# EAGLE design ATmega16 Testboard v2.2 (EAGLE 4.16)
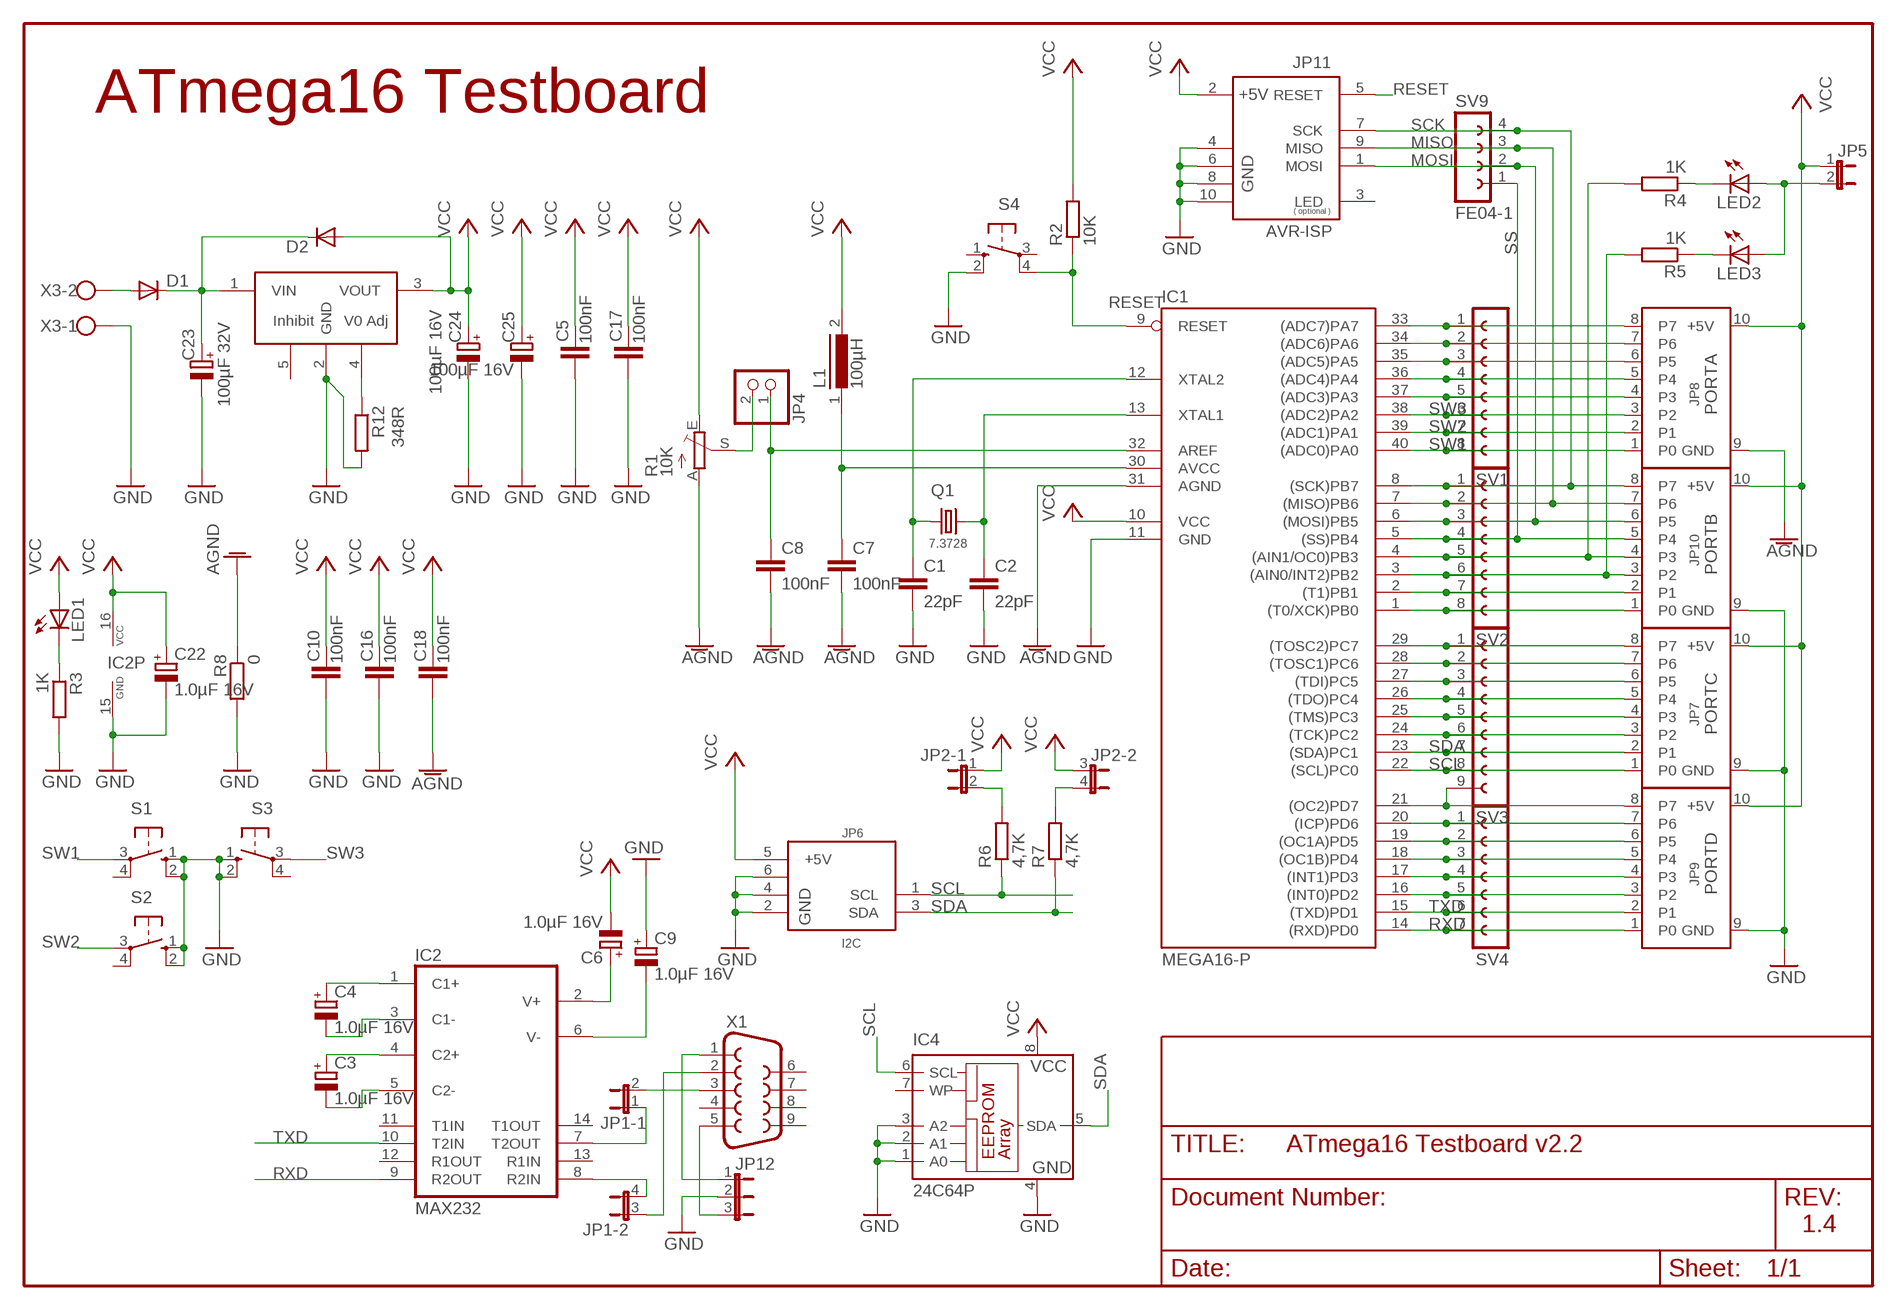
[diagram p0: schematic, sheet 1, part 1 of 2]
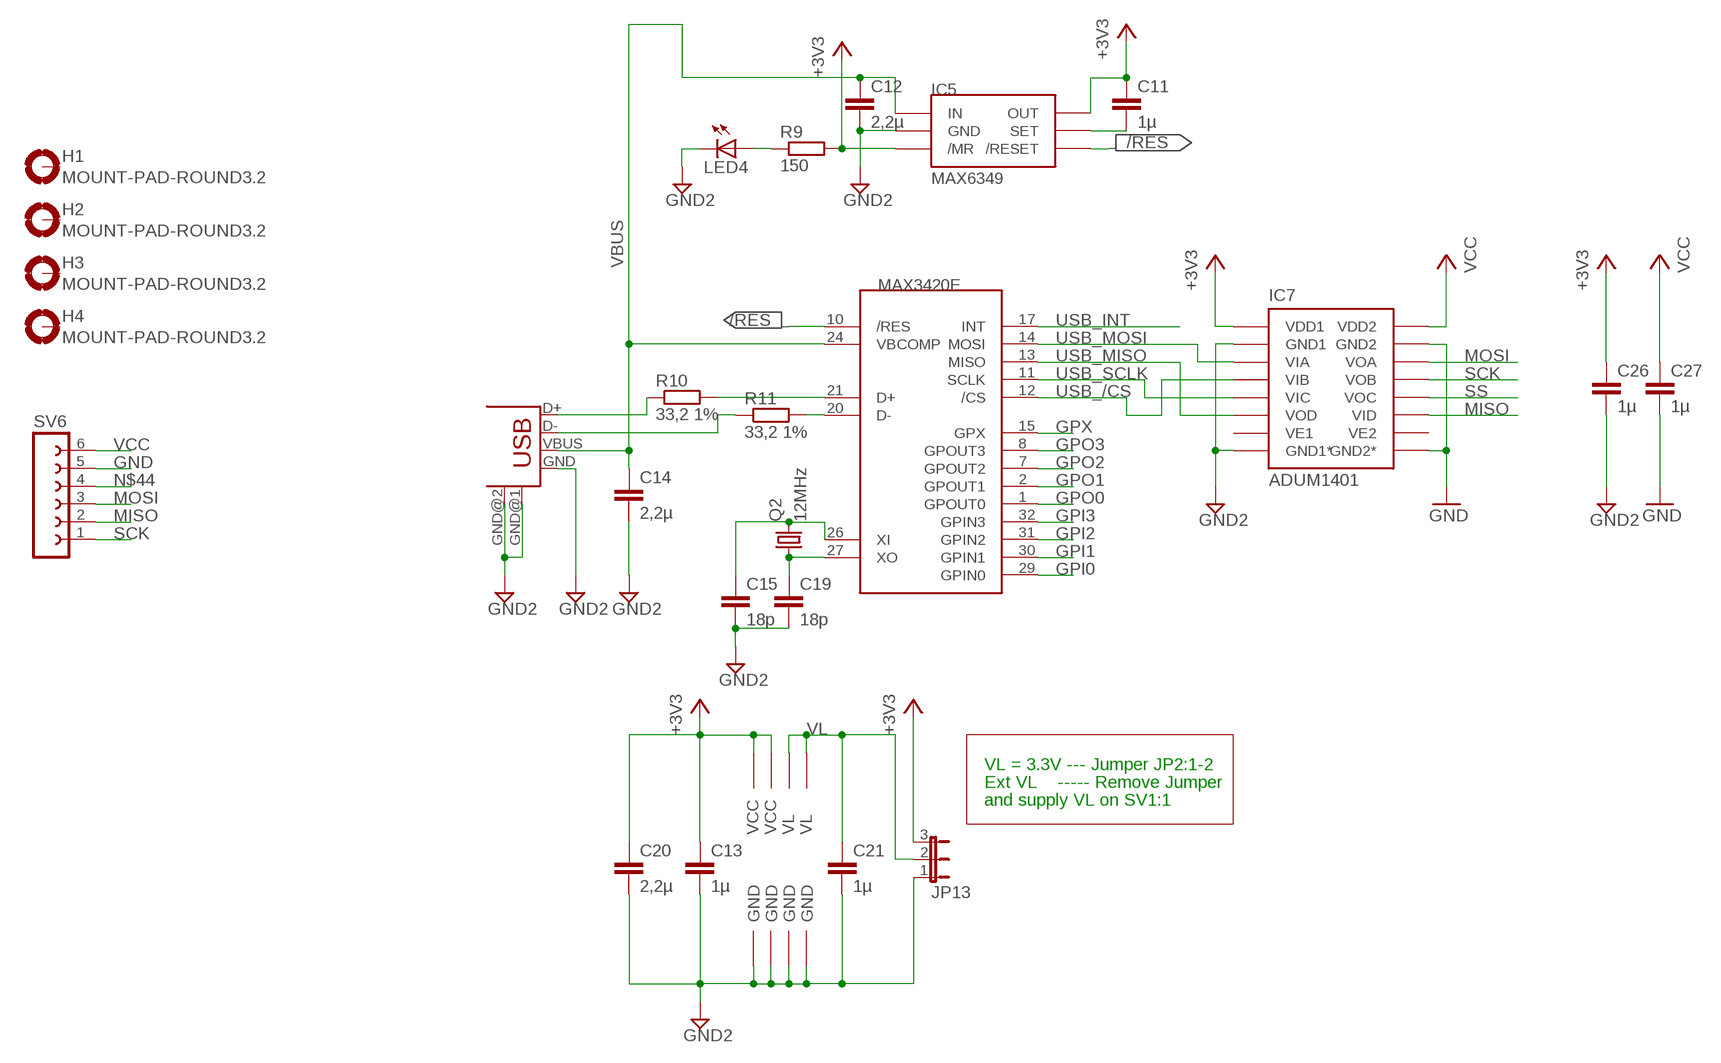
[diagram p1: schematic, sheet 1, part 2 of 2]

## Parts
C1  22pF  C-EU025-024X044  [C025-024X044]
C2  22pF  C-EU025-024X044  [C025-024X044]
C3  1.0µF 16V  CPOL-EUE1.8-4  [E1,8-4]
C4  1.0µF 16V  CPOL-EUE1.8-4  [E1,8-4]
C5  100nF  C-EU025-024X044  [C025-024X044]
C6  1.0µF 16V  CPOL-EUE1.8-4  [E1,8-4]
C7  100nF  C-EU025-024X044  [C025-024X044]
C8  100nF  C-EU025-024X044  [C025-024X044]
C9  1.0µF 16V  CPOL-EUE1.8-4  [E1,8-4]
C10  100nF  C-EU025-024X044  [C025-024X044]
C11  1µ  C-EUC0603  [C0603]
C12  2,2µ  C-EUC0603  [C0603]
C13  1µ  C-EUC0603  [C0603]
C14  2,2µ  C-EUC0603  [C0603]
C15  18p  C-EUC0402  [C0402]
C16  100nF  C-EU025-024X044  [C025-024X044]
C17  100nF  C-EU025-024X044  [C025-024X044]
C18  100nF  C-EU025-024X044  [C025-024X044]
C19  18p  C-EUC0402  [C0402]
C20  2,2µ  C-EUC0603  [C0603]
C21  1µ  C-EUC0603  [C0603]
C22  1.0µF 16V  CPOL-EUE1.8-4  [E1,8-4]
C23  100µF 32V  CPOL-EUE2.5-7  [E2,5-7]
C24  100µF 16V  CPOL-EUE2.5-6  [E2,5-6]
C25  100µF 16V  CPOL-EUE2.5-6  [E2,5-6]
C26  1µ  C-EUC0603  [C0603]
C27  1µ  C-EUC0603  [C0603]
D1  DIODE-DO34-7  [DO34-7]
D2  DIODE-DO34-7  [DO34-7]
H1  MOUNT-PAD-ROUND3.2  [3,2-PAD]
H2  MOUNT-PAD-ROUND3.2  [3,2-PAD]
H3  MOUNT-PAD-ROUND3.2  [3,2-PAD]
H4  MOUNT-PAD-ROUND3.2  [3,2-PAD]
IC1  MEGA16-P  [DIL40]
IC2  MAX232  [DIL16]
IC3  MAX3420E  [LQFP32]
IC4  24C64P  [DIL8]
IC5  MAX6349  [SOT23-6]
IC6  PTH08080W  [5DIP_MODUL]
IC7  ADUM1401  [SO16W]
JP1  JP2QE  [JP2Q]
JP2  JP2QE  [JP2Q]
JP4  PINHD-1X2V  [1X02/90]
JP5  JP1E  [JP1]
JP6  I2C  [ML6]
JP7  PORTC  PORT  [ML10]
JP8  PORTA  PORT  [ML10]
JP9  PORTD  PORT  [ML10]
JP10  PORTB  PORT  [ML10]
JP11  AVR-ISP  [ML10]
JP12  JP2E  [JP2]
JP13  JP2E  [JP2]
L1  100µH  BC12  [BC12]
LED1  LED3MM  [LED3MM]
LED2  LED3MM  [LED3MM]
LED3  LED3MM  [LED3MM]
LED4  LEDCHIPLED_0805  [CHIPLED_0805]
Q1  7.3728  CRYTALHC49U-V  [HC49U-V]
Q2  12MHz  CRYTALHC49U-V  [HC49U-V]
R1  10K  TRIM_EU-S64Y  [S64Y]
R2  10K  R-EU_0207/7  [0207/7]
R3  1K  R-EU_0207/7  [0207/7]
R4  1K  R-EU_0207/7  [0207/7]
R5  1K  R-EU_0207/7  [0207/7]
R6  4,7K  R-EU_0207/7  [0207/7]
R7  4,7K  R-EU_0207/7  [0207/7]
R8  0  R-EU_0207/2V  [0207/2V]
R9  150  R-EU_R0603  [R0603]
R10  33,2 1%  R-EU_R0603  [R0603]
R11  33,2 1%  R-EU_R0603  [R0603]
R12  348R  R-EU_0207/7  [0207/7]
S1  10-XX  [B3F-10XX]
S2  10-XX  [B3F-10XX]
S3  10-XX  [B3F-10XX]
S4  10-XX  [B3F-10XX]
SV1  FE08-1  [FE08]
SV2  FE08-1  [FE08]
SV3  FE09-1  [FE09]
SV4  FE07-1  [FE07]
SV6  FE06-1  [FE06]
SV9  FE04-1  [FE04]
USB1  USB-B-H  [USB-B-H]
X1  F09HP  [F09HP]
X3  W237-02P  [W237-132]

## Nets
+3V3 [SUP]: C11.1 C13.1 C20.1 C26.1 IC3.22(PWR:VCC$1) IC3.23(PWR:VCC$2) IC5.P$3(/MR) IC5.P$6(OUT) IC7.1(VDD1) JP13.3 R9.2
/RES: IC3.10(/RES) IC5.P$4(/RESET)
AGND [PWR]: C7.2 C8.2 C18.2 IC1.31(AGND) JP8.9(GND) R1.A R8.1
AREF: C8.1 IC1.32(AREF) JP4.1
AVCC: C7.1 IC1.30(AVCC) L1.1
GND [PWR]: C1.2 C2.2 C5.2 C9.+ C10.2 C16.2 C17.2 C22.- C23.- C24.- C25.- C27.2 IC1.11(GND) IC2.15(GND) IC4.1(A0) IC4.2(A1) IC4.3(A2) IC4.4(GND) IC6.2(GND) IC7.9(GND2*) IC7.15(GND2) JP6.2(GND$3) JP6.4(GND$2) JP6.6(GND$1) JP7.9(GND) JP9.9(GND) JP10.9(GND) JP11.4(GND1) JP11.6(GND2) JP11.8(GND3) JP11.10(GND4) JP12.2 R3.2 R8.2 R12.2 S1.1(S) S1.2(S1) S2.1(S) S2.2(S1) S3.1(S) S3.2(S1) S4.2(S1) SV6.5 X3.1
GND2 [GND2]: C12.2 C13.2 C14.2 C15.2 C19.2 C20.2 C21.2 C26.2 IC3.5(PWR:GND$1) IC3.6(PWR:GND$2) IC3.18(PWR:GND$3) IC3.19(PWR:GND$4) IC5.P$2(GND) IC7.2(GND1) IC7.8(GND1*) JP13.1 LED4.C USB1.GND USB1.GND@1(GND) USB1.GND@2(GND)
GPI0: IC3.29(GPIN0)
GPI1: IC3.30(GPIN1)
GPI2: IC3.31(GPIN2)
GPI3: IC3.32(GPIN3)
GPO0: IC3.1(GPOUT0)
GPO1: IC3.2(GPOUT1)
GPO2: IC3.7(GPOUT2)
GPO3: IC3.8(GPOUT3)
GPX: IC3.15(GPX)
INT: IC1.24((TCK)PC2) JP7.3(P2) SV3.6
MISO [SPI]: IC1.7((MISO)PB6) IC7.11(VID) JP10.7(P6) JP11.9(MISO) SV2.2 SV6.2 SV9.3
MOSI [SPI]: IC1.6((MOSI)PB5) IC7.14(VOA) JP10.6(P5) JP11.1(MOSI) SV2.3 SV6.3 SV9.2
N$1: C4.+ IC2.1(C1+)
N$2: C4.- IC2.3(C1-)
N$3: C3.+ IC2.4(C2+)
N$4: JP4.2 R1.S
N$5: IC1.3((AIN0/INT2)PB2) JP10.3(P2) R5.2 SV2.6
N$6: C2.1 IC1.13(XTAL1) Q1.2
N$7: C1.1 IC1.12(XTAL2) Q1.1
N$8: C3.- IC2.5(C2-)
N$9: C6.+ IC2.2(V+)
N$10: C9.- IC2.6(V-)
N$11: C11.2 IC5.P$5(SET)
N$12: IC1.29((TOSC2)PC7) JP7.8(P7) SV3.1
N$13: IC1.28((TOSC1)PC6) JP7.7(P6) SV3.2
N$14: IC1.27((TDI)PC5) JP7.6(P5) SV3.3
N$15: IC1.26((TDO)PC4) JP7.5(P4) SV3.4
N$16: IC1.25((TMS)PC3) JP7.4(P3) SV3.5
N$17: JP2.4 R7.2
N$18 [PWR]: C23.+ D1.C D2.C IC6.1(VIN)
N$19: JP2.2 R6.2
N$20: JP12.1 X1.1
N$21: IC1.21((OC2)PD7) JP9.8(P7) SV3.9
N$22: IC1.20((ICP)PD6) JP9.7(P6) SV4.1
N$23: IC1.19((OC1A)PD5) JP9.6(P5) SV4.2
N$24: IC1.18((OC1B)PD4) JP9.5(P4) SV4.3
N$25: IC1.17((INT1)PD3) JP9.4(P3) SV4.4
N$26: IC2.7(T2OUT) JP1.1
N$27: D1.A X3.2
N$28: JP12.3 X1.5
N$29: IC2.8(R2IN) JP1.4
N$30: LED4.A R9.1
N$31: IC3.20(D-) R11.2
N$33: R11.1 USB1.D-
N$34: IC3.21(D+) R10.2
N$35: R10.1 USB1.D+
N$36: C19.1 IC3.27(XO) Q2.1
N$37: C15.1 IC3.26(XI) Q2.2
N$42: IC6.4(VADJ) R12.1
N$44: IC1.4((AIN1/OC0)PB3) JP10.4(P3) R4.2 SV2.5 SV6.4
N$46: IC1.2((T1)PB1) JP10.2(P1) SV2.7
N$47: IC1.1((T0/XCK)PB0) JP10.1(P0) SV2.8
N$48: IC1.16((INT0)PD2) JP9.3(P2) SV4.5
N$68: LED3.K(C) R5.1
N$69: LED2.K(C) R4.1
N$71: JP5.2 LED2.A LED3.A
N$74: LED1.K(C) R3.1
PA3: IC1.37((ADC3)PA3) JP8.4(P3) SV1.5
PA4: IC1.36((ADC4)PA4) JP8.5(P4) SV1.4
PA5: IC1.35((ADC5)PA5) JP8.6(P5) SV1.3
PA6: IC1.34((ADC6)PA6) JP8.7(P6) SV1.2
PA7: IC1.33((ADC7)PA7) JP8.8(P7) SV1.1
RESET: IC1.9(RESET) JP11.5(RESET) R2.1 S4.4(P1)
RXD: IC1.14((RXD)PD0) IC2.9(R2OUT) JP9.1(P0) SV4.7
SCK [SPI]: IC1.8((SCK)PB7) IC7.13(VOB) JP10.8(P7) JP11.7(SCK) SV2.1 SV6.1 SV9.4
SCL: IC1.22((SCL)PC0) IC4.6(SCL) JP6.1(SCL) JP7.1(P0) R6.1 SV3.8
SDA: IC1.23((SDA)PC1) IC4.5(SDA) JP6.3(SDA) JP7.2(P1) R7.1 SV3.7
SRXD: JP1.3 X1.2
SS [SPI]: IC1.5((SS)PB4) IC7.12(VOC) JP10.5(P4) SV2.4 SV9.1
STXD: JP1.2 X1.3
SW1: IC1.40((ADC0)PA0) JP8.1(P0) S1.3(P) SV1.8
SW2: IC1.39((ADC1)PA1) JP8.2(P1) S2.3(P) SV1.7
SW3: IC1.38((ADC2)PA2) JP8.3(P2) S3.3(P) SV1.6
TXD: IC1.15((TXD)PD1) IC2.10(T2IN) JP9.2(P1) SV4.6
USB_/CS: IC3.12(/CS) IC7.4(VIB)
USB_INT: IC3.17(INT)
USB_MISO: IC3.13(MISO) IC7.6(VOD)
USB_MOSI: IC3.14(MOSI) IC7.3(VIA)
USB_SCLK: IC3.11(SCLK) IC7.5(VIC)
VBUS [SUP]: C12.1 C14.1 IC3.24(VBCOMP) IC5.P$1(IN) USB1.VBUS
VCC [PWR]: C5.1 C6.- C10.1 C16.1 C17.1 C18.1 C22.+ C24.+ C25.+ C27.1 D2.A IC1.10(VCC) IC2.16(VCC) IC4.8(VCC) IC6.3(VOUT) IC7.16(VDD2) JP2.1 JP2.3 JP5.1 JP6.5(+5V) JP7.10(+5V) JP8.10(+5V) JP9.10(+5V) JP10.10(+5V) JP11.2(+5V) L1.2 LED1.A R1.E R2.2 SV6.6
VL [SUP]: C21.1 IC3.3(PWR:VL$1) IC3.4(PWR:VL$2) JP13.2
Unconnected: H1.B3,2(MOUNT) H2.B3,2(MOUNT) H3.B3,2(MOUNT) H4.B3,2(MOUNT) IC2.11(T1IN) IC2.12(R1OUT) IC2.13(R1IN) IC2.14(T1OUT) IC4.7(WP) IC6.5(INHIBIT) IC7.7(VE1) IC7.10(VE2) S1.4(P1) S2.4(P1) S3.4(P1) S4.1(S) S4.3(P) X1.4 X1.6 X1.7 X1.8 X1.9

## Notes on the sheet
- ATmega16 Testboard
- VL = 3.3V --- Jumper JP2:1-2
- Ext VL    ----- Remove Jumper
- and supply VL on SV1:1
- 1.4

## Power pins joined to a net without a drawn wire
LED: JP11.3(LED)

## Library data of the parts
C1 C2 C5 C7 C8 C10-C21 C26 C27 = rcl:C-EU: CAPACITOR, European symbol
C3 C4 C6 C9 C22-C25 = rcl:CPOL-EU: POLARIZED CAPACITOR, European symbol
D1 D2 = diode:DIODE-: DIODE
H1-H4 = holes:MOUNT-PAD-ROUND: MOUNTING PAD, round
IC1 = avr:MEGA16-P
IC2 = maxim:MAX232: RS232 TRANSEIVER
IC3 = maxim:MAX3420: MAX3420E USB Peripheral Controller with SPI Interface The MAX3420E contains the digital logic and analog circuitry necessary to implement a full-speed USB peripheral compliant to USB specification rev 2.0. A built-in full-speed transceiver features ±15kV ESD protection and programmable USB connect and disconnect. An internal serial-interface engine (SIE) handles low-level USB protocol details such as error checking and bus retries. The MAX3420E operates using a register set accessed by an SPI? interface that operates up to 26MHz. Any SPI master (microprocessor, ASIC, DSP, etc.) can add USB functionality using the simple 3- or 4-wire SPI interface.
IC4 = microchip:24*: Serial EEPROM I2C
IC5 = maxim:MAX6349
IC6 = I2C:PTH08080W
IC7 = analog-devices:ADUM1401
JP1 JP2 = jumper:JP2QE: JUMPER
JP4 = pinhead:PINHD-1X2: PIN HEADER
JP5 = jumper:JP1E: JUMPER
JP6 = I2C:I2C
JP7-JP10 = andereBauteile:PORT
JP11 = roboternetz-definitionen:AVR-ISP: AVR ISP ( In System Programm ) Stecker
JP12 JP13 = jumper:JP2E: JUMPER
L1 = inductors:BC12: INDUCTOR
LED1-LED4 = led:LED: LED OSRAM: - CHIPLED LG R971, LG N971, LY N971, LG Q971, LY Q971, LO R971, LY R971 LH N974, LH R974 LS Q976, LO Q976, LY Q976 LO Q996 - Hyper CHIPLED LW Q18S LB Q993, LB Q99A, LB R99A - SideLED LS A670, LO A670, LY A670, LG A670, LP A670 LB A673, LV A673, LT A673, LW A673 LH A674 LY A675 LS A676, LA A676, LO A676, LY A676, LW A676 LS A679, LY A679, LG A679 - Hyper Micro SIDELED® LS Y876, LA Y876, LO Y876, LY Y876 LT Y87S - SmartLED LW L88C, LW L88S LB L89C, LB L89S, LG L890 LS L89K, LO L89K, LY L89K LS L896, LA L896, LO L896, LY L896 - TOPLED LS T670, LO T670, LY T670, LG T670, LP T670 LSG T670, LSP T670, LSY T670, LOP T670, LYG T670 LG T671, LOG T671, LSG T671 LB T673, LV T673, LT T673, LW T673 LH T674 LS T676, LA T676, LO T676, LY T676, LB T676, LH T676, LSB T676, LW T676 LB T67C, LV T67C, LT T67C, LS T67K, LO T67K, LY T67K, LW E67C LS E67B, LA E67B, LO E67B, LY E67B, LB E67C, LV E67C, LT E67C LW T67C LS T679, LY T679, LG T679 LS T770, LO T770, LY T770, LG T770, LP T770 LB T773, LV T773, LT T773, LW T773 LH T774 LS E675, LA E675, LY E675, LS T675 LS T776, LA T776, LO T776, LY T776, LB T776 LHGB T686 LT T68C, LB T68C - Hyper Mini TOPLED® LB M676 - Mini TOPLED Santana® LG M470 LS M47K, LO M47K, LY M47K Source: http://www.osram.convergy.de/
Q1 Q2 = crystal:CRYTAL: CRYSTAL
R1 = pot:TRIM_EU-: POTENTIOMETER
R2-R12 = rcl:R-EU_: RESISTOR, European symbol
S1-S4 = switch-omron:10-XX: OMRON SWITCH
SV1 SV2 = con-lsta:FE08-1: FEMALE HEADER
SV3 = con-lsta:FE09-1: FEMALE HEADER
SV4 = con-lsta:FE07-1: FEMALE HEADER
SV6 = con-lsta:FE06-1: FEMALE HEADER
SV9 = con-lsta:FE04-1: FEMALE HEADER
USB1 = con-usb-2:USB: USB Connectors
X1 = con-subd:F09: SUB-D
X3 = con-wago-508:W237-02P: WAGO SREW CLAMP

## Board
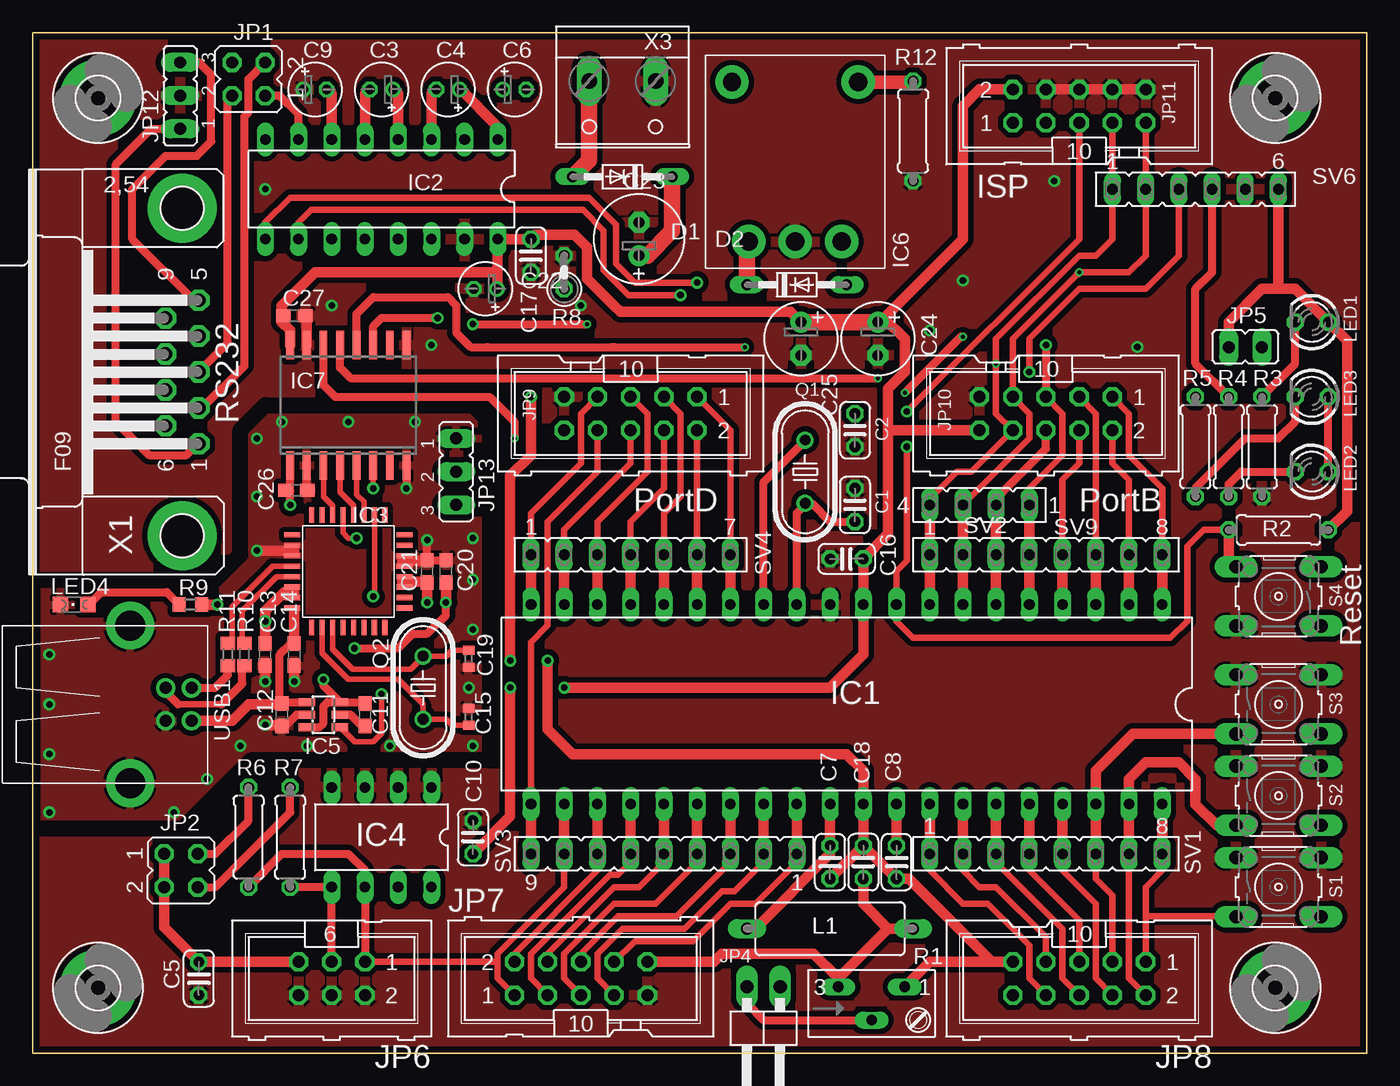
[diagram p2: board, top side]
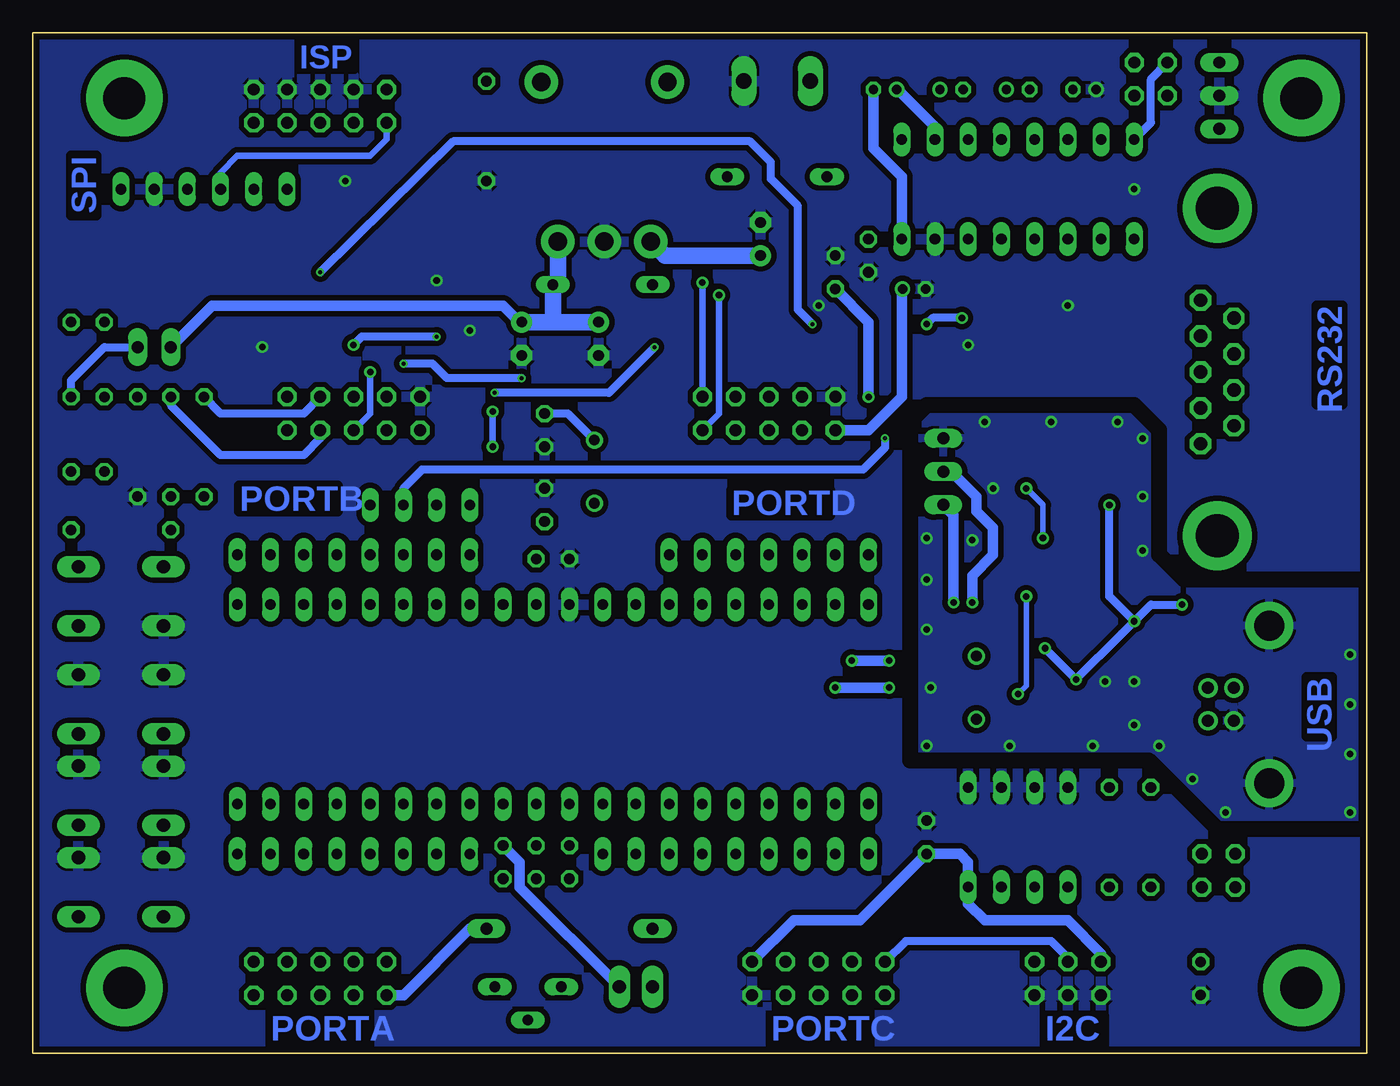
[diagram p3: board, bottom side, seen from below]

Size 102 x 78 mm. Coordinates in mm from the lower left corner, seen from the top.
Outline: 0,0 0,78 102,78 102,0 0,0
Copper layers (1*16): Top 0.035mm / dielectric 1.5mm / Bottom 0.035mm
Design rules "leiton": minimum track width 12mil, minimum drill 12mil, track to track 6mil, track to pad 6mil, pad to pad 6mil, via to via 6mil, smd to smd 6mil, copper to edge 20mil, drill to drill 8mil, minimum pad ring 8mil, minimum via ring 6mil, stop-mask expansion 3mil, vias tented up to drill 0mil, thermal gap 8mil
tRestrict: 11 lines
bRestrict: 11 lines
Milling: 4 lines

### Footprints (pad centres in the part's own frame; a part is rotated, then mirrored left to right if it is on the bottom)
C025-024X044 = drill 0.813 octagon: 1 -1.27,0; 2 1.27,0
E1,8-4 = drill 0.711 pad 1.168 round: + -0.889,0 | drill 0.711 pad 1.168 octagon: - 0.889,0
C0603 = smd 1.1 x 1: 1 -0.85,0; 2 0.85,0
C0402 = smd 0.7 x 0.9: 1 -0.65,0; 2 0.65,0
E2,5-7 = drill 0.813 pad 1.6 round: + -1.27,0 | drill 0.813 pad 1.6 octagon: - 1.27,0
E2,5-6 = drill 0.813 pad 1.6 round: + -1.27,0 | drill 0.813 pad 1.6 octagon: - 1.27,0
DO34-7 = drill 0.813 long: A 3.81,0; C -3.81,0
3,2-PAD = drill 3.2 pad 5.842 round: B3,2 0,0
DIL40 = drill 0.813 long: 1 -24.13,-7.62; 2 -21.59,-7.62; 3 -19.05,-7.62; 4 -16.51,-7.62; 5 -13.97,-7.62; 6 -11.43,-7.62; 7 -8.89,-7.62; 8 -6.35,-7.62; 9 -3.81,-7.62; 10 -1.27,-7.62; 11 1.27,-7.62; 12 3.81,-7.62; 13 6.35,-7.62; 14 8.89,-7.62; 15 11.43,-7.62; 16 13.97,-7.62; 17 16.51,-7.62; 18 19.05,-7.62; 19 21.59,-7.62; 20 24.13,-7.62; 21 24.13,7.62; 22 21.59,7.62; 23 19.05,7.62; 24 16.51,7.62; 25 13.97,7.62; 26 11.43,7.62; 27 8.89,7.62; 28 6.35,7.62; 29 3.81,7.62; 30 1.27,7.62; 31 -1.27,7.62; 32 -3.81,7.62; 33 -6.35,7.62; 34 -8.89,7.62; 35 -11.43,7.62; 36 -13.97,7.62; 37 -16.51,7.62; 38 -19.05,7.62; 39 -21.59,7.62; 40 -24.13,7.62
DIL16 = drill 0.813 long: 1 -8.89,-3.81; 2 -6.35,-3.81; 3 -3.81,-3.81; 4 -1.27,-3.81; 5 1.27,-3.81; 6 3.81,-3.81; 7 6.35,-3.81; 8 8.89,-3.81; 9 8.89,3.81; 10 6.35,3.81; 11 3.81,3.81; 12 1.27,3.81; 13 -1.27,3.81; 14 -3.81,3.81; 15 -6.35,3.81; 16 -8.89,3.81
LQFP32 = smd 0.4 x 1.2: 1 -2.8,-4.3; 2 -2,-4.3; 3 -1.2,-4.3; 4 -0.4,-4.3; 5 0.4,-4.3; 6 1.2,-4.3; 7 2,-4.3; 8 2.8,-4.3; 17 2.8,4.3; 18 2,4.3; 19 1.2,4.3; 20 0.4,4.3; 21 -0.4,4.3; 22 -1.2,4.3; 23 -2,4.3; 24 -2.8,4.3 | smd 1.2 x 0.4: 9 4.3,-2.8; 10 4.3,-2; 11 4.3,-1.2; 12 4.3,-0.4; 13 4.3,0.4; 14 4.3,1.2; 15 4.3,2; 16 4.3,2.8; 25 -4.3,2.8; 26 -4.3,2; 27 -4.3,1.2; 28 -4.3,0.4; 29 -4.3,-0.4; 30 -4.3,-1.2; 31 -4.3,-2; 32 -4.3,-2.8
DIL8 = drill 0.813 long: 1 -3.81,-3.81; 2 -1.27,-3.81; 3 1.27,-3.81; 4 3.81,-3.81; 5 3.81,3.81; 6 1.27,3.81; 7 -1.27,3.81; 8 -3.81,3.81
SOT23-6 = smd 0.635 x 1.27: P$1 -0.953,-1.27; P$2 0,-1.27; P$3 0.953,-1.27; P$4 0.953,1.27; P$5 0,1.27; P$6 -0.953,1.27
5DIP_MODUL = drill 1.4 pad 2.54 round: 1 -5.588,3.048; 2 -5.588,-0.508; 3 -5.588,-4.064; 4 6.604,-5.334; 5 6.604,4.318
SO16W = smd 0.6 x 2.2: 1 -4.445,-4.6; 2 -3.175,-4.6; 3 -1.905,-4.6; 4 -0.635,-4.6; 5 0.635,-4.6; 6 1.905,-4.6; 7 3.175,-4.6; 8 4.445,-4.6; 9 4.445,4.6; 10 3.175,4.6; 11 1.905,4.6; 12 0.635,4.6; 13 -0.635,4.6; 14 -1.905,4.6; 15 -3.175,4.6; 16 -4.445,4.6
JP2Q = drill 0.914 octagon: 1 -1.27,-1.27; 2 -1.27,1.27; 3 1.27,-1.27; 4 1.27,1.27
1X02/90 = drill 1.016 long: 1 -1.27,0; 2 1.27,0
JP1 = drill 0.914 long: 1 0,-1.27; 2 0,1.27
ML6 = drill 0.914 octagon: 1 -2.54,-1.27; 2 -2.54,1.27; 3 0,-1.27; 4 0,1.27; 5 2.54,-1.27; 6 2.54,1.27
ML10 = drill 0.914 octagon: 1 -5.08,-1.27; 2 -5.08,1.27; 3 -2.54,-1.27; 4 -2.54,1.27; 5 0,-1.27; 6 0,1.27; 7 2.54,-1.27; 8 2.54,1.27; 9 5.08,-1.27; 10 5.08,1.27
JP2 = drill 0.914 long: 1 -2.54,0; 2 0,0; 3 2.54,0
BC12 = drill 0.914 long: 1 -6.35,0; 2 6.35,0
LED3MM = drill 0.813 octagon: A -1.27,0; K 1.27,0
CHIPLED_0805 = smd 1.2 x 1.2: A 0,-1.05; C 0,1.05
HC49U-V = drill 0.813 round: 1 -2.413,0; 2 2.413,0
S64Y = drill 0.813 long: A 2.54,1.27; E -2.54,1.27; S 0,-1.27
0207/7 = drill 0.813 octagon: 1 -3.81,0; 2 3.81,0
0207/2V = drill 0.813 octagon: 1 -1.27,0; 2 1.27,0
R0603 = smd 1 x 1.1: 1 -0.85,0; 2 0.85,0
B3F-10XX = drill 1.016 long: 1 -3.251,2.261; 2 3.251,2.261; 3 -3.251,-2.261; 4 3.251,-2.261
FE08 = drill 0.813 long: 1 -8.89,0; 2 -6.35,0; 3 -3.81,0; 4 -1.27,0; 5 1.27,0; 6 3.81,0; 7 6.35,0; 8 8.89,0
FE09 = drill 0.813 long: 1 -10.16,0; 2 -7.62,0; 3 -5.08,0; 4 -2.54,0; 5 0,0; 6 2.54,0; 7 5.08,0; 8 7.62,0; 9 10.16,0
FE07 = drill 0.813 long: 1 -7.62,0; 2 -5.08,0; 3 -2.54,0; 4 0,0; 5 2.54,0; 6 5.08,0; 7 7.62,0
FE06 = drill 0.813 long: 1 -6.35,0; 2 -3.81,0; 3 -1.27,0; 4 1.27,0; 5 3.81,0; 6 6.35,0
FE04 = drill 0.813 long: 1 -3.81,0; 2 -1.27,0; 3 1.27,0; 4 3.81,0
USB-B-H = drill 0.914 round: D+ 0,1.25; D- 1.981,1.25; GND 0,-1.25; VBUS 1.981,-1.25 | drill 2.286 round: GND@1 -2.718,6.02; GND@2 -2.718,-6.02
F09HP = drill 1.016 octagon: 1 -5.486,-1.27; 2 -2.743,-1.27; 3 0,-1.27; 4 2.743,-1.27; 5 5.486,-1.27; 6 -4.115,1.27; 7 -1.372,1.27; 8 1.372,1.27; 9 4.115,1.27 | drill 3.302 pad 5.08 round: G1 -12.522,0; G2 12.522,0
W237-132 = drill 1.194 long: 1 -2.54,-0.635; 2 2.54,-0.635

### Placement (x,y rotation side)
C1  62.87,41.91 90 top
C2  62.87,47.62 270 top
C3  26.67,73.66 180 top
C4  31.75,73.66 180 top
C5  12.7,5.71 270 top
C6  36.83,73.66 0 top
C7  60.96,14.61 270 top
C8  66.04,14.61 270 top
C9  21.59,73.66 0 top
C10  33.66,16.51 90 top
C11  25.4,25.88 270 top
C12  19.05,25.88 270 top
C13  17.78,30.48 270 top
C14  20,30.48 270 top
C15  33.34,25.72 90 top
C16  62.23,37.78 180 top
C17  38.1,60.96 270 top
C18  63.5,14.61 90 top
C19  33.34,30.16 270 top
C20  31.59,36.83 90 top
C21  30.16,36.83 90 top
C22  34.61,58.42 180 top
C23  46.35,62.23 90 top
C24  64.61,54.61 270 top
C25  58.74,54.61 270 top
C26  20.16,43.02 0 top
C27  20,56.36 0 top
D1  45.09,66.99 180 top
D2  58.42,58.74 0 top
H1  5,5 0 top
H2  95,5 0 top
H3  95,73 0 top
H4  5,73 0 top
IC1  62.23,26.67 180 top
IC2  26.67,66.04 180 top
IC3  24.13,36.83 90 top
IC4  26.67,16.51 180 top
IC5  22.23,25.88 270 top
IC6  57.78,67.63 90 top
IC7  24.13,49.53 0 top
JP1  16.51,74.45 90 top
JP2  11.34,13.97 270 top
JP4  55.88,5.08 180 top
JP5  92.71,53.98 270 top
JP6  22.86,5.71 180 top
JP7  41.91,5.71 0 top
JP8  80.01,5.71 180 top
JP9  45.72,48.9 180 top
JP10  77.47,48.9 180 top
JP11  80.01,72.39 0 top
JP12  11.27,73.18 90 top
JP13  32.38,44.45 270 top
L1  60.96,9.53 0 top
LED1  97.79,55.88 180 top
LED2  97.79,44.45 180 top
LED3  97.79,50.16 180 top
LED4  3.17,34.29 90 top
Q1  59.05,44.45 90 top
Q2  29.84,27.94 270 top
R1  64.14,3.81 0 top
R2  95.25,40.01 0 top
R3  93.98,46.35 270 top
R4  91.44,46.35 90 top
R5  88.9,46.35 90 top
R6  16.51,16.51 90 top
R7  19.68,16.51 90 top
R8  40.64,59.69 90 top
R9  12.06,34.29 0 top
R10  16.19,30.48 90 top
R11  14.92,30.48 90 top
R12  67.31,70.48 270 top
S1  95.25,12.7 0 top
S2  95.25,19.68 0 top
S3  95.25,26.67 0 top
S4  95.25,34.92 180 top
SV1  77.47,15.24 0 top
SV2  77.47,38.1 0 top
SV3  48.26,15.24 180 top
SV4  45.72,38.1 0 top
SV6  88.9,66.04 0 top
SV9  72.39,41.91 180 top
USB1  10.16,26.67 0 top
X1  11.43,52.07 90 top
X3  45.09,73.66 180 top

### Tracks (layer width: path | path; a pad name or v marks a point on that pad's centre or on a via)
+3V3  (via drill 0.5)
  Top 0.406: IC3.23 19.83,35.07 20,35.24 19.83,35.41 IC3.22
  Top 0.61: IC5.P$3 21.91,24.92 22.23,25.24 22.23,26.51 22.54,26.83 IC5.P$6 | C11.1 25.4,26.67 25.24,26.83 IC5.P$6 | 17.84,31.27 17.84,31.33 | v24.61,30.96 27.94,30.96 29.05,32.07 30.16,32.07 31.59,33.5 v31.59,34.45 | v22.23,28.57 22.23,28.1 IC5.P$6 | IC7.1 v19.68,41.91 19.68,42.97 C26.1
  Top 0.813: 20,35.24 19.21,35.24 17.78,33.81 v17.78,33.02 C13.1 17.84,31.27 | v14.13,34.29 R9.2 | v31.59,34.45 C20.1
  Bottom 0.61: v24.61,30.96 v22.23,28.57 18.73,32.07 v17.78,33.02 | v14.13,34.29 16.51,34.29 v17.78,33.02 | v19.68,41.91 19.68,34.92 v17.78,33.02
  Bottom 0.813: v31.59,34.45 31.59,41.12 JP13.3
/RES  (via drill 0.5)
  Top 0.406: IC3.10 26.13,35.02 v26.04,34.92 | v26.67,27.46 26.67,24.45 26.04,23.81 24.61,23.81 IC5.P$4
  Bottom 0.406: v26.04,34.92 26.04,28.1 v26.67,27.46
AGND  (via drill 0.5)
  Top 0.813: 73.34,6.99 68.58,6.99 R1.A | 73.34,6.99 JP8.9 | 73.34,6.99 66.99,13.34 C8.2 C18.2 | C18.2 IC1.31 63.5,21.59 62.23,22.86 41.27,22.86 39.37,24.77 v39.37,30 | C18.2 C7.2 | v36.51,30 36.51,42.23 | 36.51,42.23 | 36.51,42.23 36.51,44.13 38.1,45.72 v38.1,50.16
  Bottom 0.813: v39.37,30 v36.51,30 | R8.1 | R8.1 38.1,55.88 v38.1,50.16
AREF
  Top 0.813: C8.1 IC1.32
  Bottom 0.813: C8.1 64.77,14.61 64.77,12.7 JP4.1
AVCC
  Top 0.813: IC1.30 C7.1 60.96,15.24 55.24,9.53 L1.1
GND  (via drill 0.5)
  Top 0.813: JP11.4 JP11.6 JP11.8 JP11.10 | C27.2 20.95,56.36 IC7.15
  other vias: 30.48,54.13 41.91,57.15 84.45,53.98 68.58,55.24 71.12,59.05 78.11,66.67 17.78,66.04 22.86,57.15
  pour Bottom (isolate 0.406, rank 2): 0,78.74 102.87,78.74 102.87,0 0,0
  pour Top (isolate 0.406, rank 2): 0,78.74 102.87,78.74 102.87,0 0,0
GND2  (via drill 0.5)
  Top 0.406: IC3.6 28.43,37.8 28.26,37.62 28.43,37.45 IC3.5 | IC3.19 19.83,38.24 20,38.42 19.83,38.59 IC3.18
  Top 0.61: 30.16,37.78 v30.16,39.21 | C21.2 30.16,37.78 | C20.2 30.27,37.68 30.16,37.78 | IC5.P$2 20.16,25.88 19.21,24.92 19.05,24.92 C12.2 | IC7.8 v28.57,43.18 | C26.2 21.11,43.18 20.95,43.34 IC7.2
  Top 0.813: C13.2 v17.78,28.42 | C14.2 v20,28.42 | C12.2 18.99,25.08 v17.78,25.08 | C21.2 30.16,37.62 28.26,37.62 | 20,38.42 v17.14,38.42
  other vias: 33.34,27.94 17.14,42.55 17.14,46.99 19.05,48.26 24.13,48.26 29.21,48.26 33.66,39.37 33.66,32.38 33.66,23.5 27.3,23.5 20.95,23.5 15.88,23.5 13.34,20.95 10.79,18.41 33.66,36.2 1.27,18.41 1.27,22.86 1.27,26.67 1.27,30.48
  pour Bottom (isolate 0.406): 0,35.56 13.97,35.56 16.51,38.1 16.51,48.26 17.78,49.53 34.29,49.53 34.29,22.86 16.51,22.86 11.43,17.78 0,17.78
  pour Top (isolate 0.406): 0,35.56 13.97,35.56 16.51,38.1 16.51,48.26 17.78,49.53 34.29,49.53 34.29,22.86 16.51,22.86 11.43,17.78 0,17.78
INT
  Top 0.508: JP7.3 38.1,5.71 38.1,7.62 44.13,13.65 44.77,13.65 45.72,14.61 SV3.6
  Top 0.813: SV3.6 IC1.24
MISO  (via drill 0.3, 0.5)
  Top 0.508: SV9.3 76.2,46.99 76.2,48.9 JP10.7 74.93,54.61 79.93,59.61 v80.01,59.69 83.82,59.69 85.09,60.96 SV6.2 JP11.9
  Top 0.61: v80.01,59.69 79.93,59.61 | IC7.11 26.04,55.56 26.67,56.2 v30.96,56.2 | v33.66,55.72 39.85,55.72 41.91,55.72 v42.39,55.72
  Top 0.813: IC1.7 SV2.2 SV9.3
  Bottom 0.61: v42.39,55.72 43.5,56.83 43.5,64.77 45.56,66.83 45.56,68.1 47.15,69.69 69.85,69.69 v80.01,59.69 | v30.96,56.2 33.18,56.2 v33.66,55.72
MOSI  (via drill 0.3, 0.5)  (1 unrouted)
  Top 0.508: SV6.3 87.63,60.96 85.09,58.42 80.01,58.42 76.2,54.61 v76.2,52.07
  Top 0.61: SV9.2 73.66,42.39 77.47,46.2 JP10.6 | IC7.14 22.23,53.18 22.23,51.06 23.12,50.16 34.92,50.16 36.83,48.26 v36.83,46.99
  Top 0.813: IC1.6 SV2.3 SV9.2
  Bottom 0.508: v76.2,52.07 76.2,48.9 JP10.6 | JP11.1 74.93,69.85 76.2,68.58 86.36,68.58 87.63,67.31 SV6.3
  Bottom 0.61: v36.83,46.99 36.83,46.3 38.52,44.61 72.23,44.61 73.66,43.18 SV9.2
N$1
  Top 0.813: C4.+ 32.7,73.66 35.56,70.8 IC2.1
N$2
  Top 0.813: C4.- 30.8,73.66 30.48,73.34 IC2.3
N$3
  Top 0.813: C3.+ 27.62,73.66 27.94,73.34 IC2.4
N$4
  Top 0.61: JP4.2 54.61,3.81 55.88,2.54 R1.S
N$5
  Top 0.508: SV2.6 81.28,48.9 JP10.3
  Top 0.813: IC1.3 SV2.6
  Bottom 0.61: R5.2 87.63,48.9 81.28,48.9 JP10.3
N$6
  Top 0.61: Q1.2 59.05,46.83 55.88,43.66 IC1.13
  Bottom 0.61: Q1.2 61.09,48.9 C2.1
N$7
  Top 0.61: IC1.12 58.42,41.27 59.05,41.91 Q1.1 59.56,42.04 60.96,40.64 C1.1
N$8
  Top 0.813: C3.- 25.72,73.66 25.4,73.34 IC2.5
N$9
  Bottom 0.813: C6.+ 35.88,73.66 33.02,70.8 IC2.2
N$10
  Top 0.813: C9.- 22.54,73.66 22.86,73.34 IC2.6
N$11
  Top 0.61: C11.2 25.14,25.03 24.29,25.88 IC5.P$5
N$12
  Top 0.508: SV3.1 58.42,14.61 55.24,11.43 53.34,11.43 50.48,8.57 46.04,8.57 JP7.8
  Top 0.813: SV3.1 IC1.29
N$13
  Top 0.508: SV3.2 55.88,14.61 53.66,12.38 52.7,12.38 49.85,9.53 45.09,9.53 43.18,7.62 43.18,5.71 JP7.7
  Top 0.813: SV3.2 IC1.28
N$14
  Top 0.508: SV3.3 53.34,14.61 49.21,10.48 44.77,10.48 41.91,7.62 JP7.6
  Top 0.813: SV3.3 IC1.27
N$15
  Top 0.508: SV3.4 50.8,14.61 47.62,11.43 44.45,11.43 40.64,7.62 40.64,5.71 JP7.5
  Top 0.813: SV3.4 IC1.26
N$16
  Top 0.508: JP7.4 39.37,7.62 44.45,12.7 46.35,12.7 48.26,14.61 SV3.5
  Top 0.813: SV3.5 IC1.25
N$17
  Top 0.61: R7.2 19.68,18.41 13.97,12.7 JP2.4
N$18
  Top 1.27: D1.C 48.9,62.87 46.99,60.96 C23.+ | C23.+ | IC6.1 54.61,61.91 D2.C
  Bottom 1.27: C23.+ | C23.+ 53.66,60.96 IC6.1 54.77,62.07
N$19
  Top 0.61: R6.2 16.51,17.78 13.97,15.24 JP2.2
N$20
  Top 0.61: X1.1 12.61,46.58 11.75,45.72 8.89,45.72 6.35,48.26 6.35,67.94 9.05,70.64 JP12.1
N$21
  Top 0.508: IC1.21 38.1,31.43 39.37,32.7 39.37,40.64 43.18,44.45 JP9.8
  Top 0.813: SV3.9 IC1.21
N$22
  Top 0.508: SV4.1 38.1,41.27 41.91,45.09 41.91,48.9 JP9.7
  Top 0.813: IC1.20 SV4.1
N$23
  Top 0.508: SV4.2 40.64,40.01 45.72,45.09 JP9.6
  Top 0.813: IC1.19 SV4.2
N$24
  Top 0.508: SV4.3 43.18,40.64 46.99,44.45 46.99,48.9 JP9.5
  Top 0.813: IC1.18 SV4.3
N$25
  Top 0.508: SV4.4 45.72,40.64 48.26,43.18 JP9.4
  Top 0.813: IC1.17 SV4.4
N$26
  Top 0.61: JP1.1 18.89,73.18 20.32,71.75 IC2.7
N$27
  Top 1.27: X3.2 42.55,68.26 D1.A
N$28
  Top 0.61: X1.5 12.29,57.56 7.62,62.23 7.62,66.04 10.16,68.58 12.54,68.58 13.65,69.69 13.65,74.77 12.7,75.72 JP12.3
N$29
  Bottom 0.61: JP1.4 16.51,74.45 16.51,71.12 IC2.8
N$30
  Top 0.61: R9.1 10.26,35.24 5.24,35.24 4.29,34.29 | 4.29,34.29 | LED4.A 4.29,34.29
N$31
  Top 0.406: IC3.20 18.34,37.23 15.24,34.13 15.24,31.59 14.92,31.27 R11.2
N$33
  Top 0.61: R11.1 14.92,28.89 13.95,27.92 USB1.D-
N$34
  Top 0.406: IC3.21 18.65,36.43 16.03,33.81 16.03,31.43 16.19,31.27 R10.2
N$35
  Top 0.508: 11.11,26.67 14.45,26.67
  Top 0.61: USB1.D+ 10.16,27.62 11.11,26.67 | 14.45,26.67 16.03,28.26 16.03,29.53 16.19,29.69 R10.1
N$36
  Top 0.406: C19.1 33.34,30.8 32.07,30.8 31.62,30.35 Q2.1 29.84,30.32 28.89,29.37 24.45,29.37 22.93,30.89 IC3.27
N$37
  Top 0.406: C15.1 33.34,25.08 32.07,25.08 31.62,25.53 Q2.2 29.84,26.67 27.94,28.57 24.13,28.57 22.13,30.57 IC3.26
N$42
  Top 1.016: IC6.4 67.25,74.23 R12.1
N$44
  Top 0.508: SV2.5 78.74,43.81 80.01,45.09 JP10.4
  Top 0.61: SV6.4 90.17,59.69 88.9,58.42 88.9,52.7 R4.2
  Top 0.813: IC1.4 SV2.5
  Bottom 0.61: R4.2 91.44,49.53 87.63,45.72 81.28,45.72 80.01,46.99 JP10.4
N$46
  Top 0.508: SV2.7 83.82,43.81 82.55,45.09 JP10.2
  Top 0.813: IC1.2 SV2.7
N$47
  Top 0.508: SV2.8 86.36,43.18 83.82,45.72 83.82,48.9 JP10.1
  Top 0.813: IC1.1 SV2.8
N$48
  Top 0.508: SV4.5 48.26,41.27 49.53,42.55 49.53,48.9 JP9.3
  Top 0.813: IC1.16 SV4.5
N$68
  Top 0.61: LED3.K 96.52,48.26 95.25,46.99 92.71,46.99 88.9,43.18 R5.1
N$69
  Top 0.61: LED2.K 92.39,44.45 91.44,43.5 R4.1
N$71
  Top 0.61: LED2.A LED3.A
  Bottom 0.61: LED3.A 99.06,51.44 96.52,53.98 JP5.2
N$74
  Top 0.61: R3.1 96.52,52.7 LED1.K
PA3
  Top 0.508: SV1.5 78.74,13.97 81.28,11.43 81.28,5.71 JP8.4
  Top 0.813: SV1.5 IC1.37
PA4
  Top 0.508: SV1.4 76.2,13.97 80.01,10.16 JP8.5
  Top 0.813: SV1.4 IC1.36
PA5
  Top 0.508: SV1.3 73.66,14.61 78.74,9.53 78.74,5.71 JP8.6
  Top 0.813: SV1.3 IC1.35
PA6
  Top 0.508: JP8.7 77.47,8.89 73.66,12.7 72.39,12.7 71.12,13.97 SV1.2
  Top 0.813: SV1.2 IC1.34
PA7
  Top 0.508: SV1.1 68.58,13.97 71.12,11.43 73.03,11.43 76.2,8.26 76.2,5.71 JP8.8
  Top 0.813: SV1.1 IC1.33
RESET  (via drill 0.5)
  Top 0.508: JP11.5 80.01,62.23 v66.83,49.05 | R2.1 89.53,40.01 88.27,38.73 88.27,33.02 87,31.75 67.31,31.75 66.04,33.02 IC1.9 66.04,36.83 66.83,37.62 v66.83,46.35
  Top 0.813: 92.04,37.19 92.08,37.15 | 92.04,37.19 S4.4 | R2.1 91.44,37.78 92.04,37.19
  Bottom 0.508: v66.83,46.35 v66.83,49.05
RXD  (via drill 0.5)
  Top 0.508: SV4.7 53.34,47.62 JP9.1 | IC2.9 17.78,63.5 19.68,65.41 42.55,65.41 44.61,63.34 44.61,60.33 45.56,59.37 46.04,58.9 v50.8,58.9
  Top 0.813: SV4.7 IC1.14
  Bottom 0.508: v50.8,58.9 JP9.1
SCK  (via drill 0.3)
  Top 0.508: JP11.7 SV6.1 82.55,62.23 81.28,60.96 80.01,60.96 73.66,54.61 v73.66,52.7 73.66,48.9 JP10.8 71.75,44.45 70.64,44.45 68.58,42.39 SV9.4
  Top 0.61: IC7.13 23.5,52.39 24.29,51.59 v64.61,51.59 | v64.61,51.59 | v73.66,52.7
  Top 0.813: IC1.8 SV2.1 SV9.4
  Bottom 0.61: v64.61,51.59 70.33,51.59 71.44,52.7 v73.66,52.7
SCL
  Top 0.508: SV3.8 40.64,12.7 35.56,7.62 35.56,6.99 | 35.56,6.99 35.56,5.71 JP7.1 | JP6.1 35.56,6.99
  Top 0.61: R6.1 19.05,15.24 24.13,15.24 25.4,13.97 IC4.6 JP6.1
  Top 0.813: SV3.8 IC1.22
SDA
  Top 0.508: SV3.7 43.18,13.97 36.83,7.62 JP7.2
  Top 0.61: JP6.3 IC4.5 R7.1
  Top 0.813: SV3.7 IC1.23
  Bottom 0.61: JP6.3 22.86,7.3 24.13,8.57 35.24,8.57 JP7.2
SRXD
  Top 0.61: X1.2 12.97,49.33 16.19,52.55 16.19,71.6 16.51,71.91 16.51,74.45 JP1.3
SS  (via drill 0.3, 0.5)
  Top 0.508: SV9.1 76.2,43.18 78.74,45.72 78.74,48.9 JP10.5
  Top 0.61: v77.47,54.13 JP10.5 | 44.45,53.98 44.29,53.98 | 44.45,53.98 v54.45,53.98 | v66.67,50.48 70.96,54.77 v71.12,54.77 | 34.77,53.98 | 34.77,53.98 44.45,53.98 | 34.77,53.98 33.5,53.98 32.38,55.09 32.38,57.15 31.75,57.78 26.04,57.78 24.77,56.52 IC7.12
  Top 0.813: IC1.5 SV2.4 SV9.1
  Bottom 0.61: v54.45,53.98 57.94,50.48 v66.67,50.48 | v71.12,54.77 76.83,54.77 v77.47,54.13
STXD
  Top 0.61: X1.3 14.92,54.29 14.92,72.87 JP1.2
SW1
  Top 0.508: JP8.1 85.09,10.48 | 85.09,10.48 85.09,12.7 86.36,13.97 SV1.8 | S1.3 90.41,10.48 85.09,10.48
  Top 0.813: SV1.8 IC1.40
SW2
  Top 0.508: SV1.7 83.82,5.71 JP8.2
  Top 0.813: SV1.7 IC1.39 83.82,20.95 85.09,22.23 87.63,22.23 88.9,20.95 88.9,19.05 90.53,17.42 S2.3
SW3
  Top 0.508: SV1.6 81.28,13.34 82.55,12.06 JP8.3
  Top 0.813: SV1.6 IC1.38 81.28,21.59 84.1,24.41 S3.3
TXD  (via drill 0.5)
  Top 0.508: JP9.2 SV4.6 | IC2.10 20.32,63.5 21.27,64.45 42.07,64.45 43.66,62.87 43.66,59.85 45.56,57.94 v49.53,57.94
  Top 0.813: SV4.6 IC1.15
  Bottom 0.508: JP9.2 49.53,48.9 v49.53,57.94
USB_/CS
  Top 0.406: IC3.12 24.53,41.83 23.5,42.86 IC7.4
USB_MISO  (via drill 0.5)
  Top 0.406: IC3.13 23.73,39.77 24.13,39.37 v24.77,39.37 | v26.04,43.18 IC7.6
  Bottom 0.406: v24.77,39.37 24.77,41.91 v26.04,43.18
USB_MOSI
  Top 0.406: IC3.14 22.93,41.84 22.23,42.55 IC7.3
USB_SCLK
  Top 0.406: IC3.11 25.33,42.14 24.77,42.7 IC7.5
VBUS
  Top 0.406: IC3.24 19.83,33.96 20,33.81
  Top 0.61: IC5.P$1 19.21,26.83 19.05,26.67 18.89,26.83 18.89,30.48 19.74,31.33 C14.1
  Top 0.813: C14.1 20,33.81 | USB1.VBUS 15.26,25.42 16.51,26.67 19.05,26.67 C12.1
VCC  (via drill 0.5)
  Top 0.813: JP6.5 C5.1 10.06,9.62 JP2.3 10.16,12.7 10.06,12.79 JP2.1 | 61.59,5.71 R1.E | 61.59,5.71 59.69,7.62 52.7,7.62 52.07,6.99 JP7.10 | 65.41,9.53 L1.2 | 61.59,5.71 65.41,9.53 | JP5.1 91.44,55.88 93.98,58.42 95.25,58.42 | 95.25,58.42 96.52,58.42 LED1.A 100.49,54.45 100.49,41.43 R2.2 | 95.25,58.42 SV6.6 | C18.1 63.5,11.43 65.41,9.53 | JP11.2 72.39,73.66 71.12,72.39 71.12,62.23 64.77,55.88 | v40.64,27.94 60.96,27.94 63.5,30.48 IC1.10 C16.1 65.41,39.69 65.41,47.62 | C10.1 36.51,18.1 v36.51,27.94 | 47.47,56.67 57.94,56.67 C25.+ | 65.41,47.62 JP10.10 | 44.45,57.15 42.39,59.21 42.39,61.59 41.43,62.55 38.42,62.55 C17.1 IC2.16 35.56,59.69 | 44.45,57.15 | 44.45,57.15 44.93,56.67 47.47,56.67 | 47.47,56.67 | C22.+ 35.56,58.48 35.56,59.69 | 35.56,59.69 21.59,59.69 19.05,57.15 19.05,56.52 19.15,56.41 C27.1 19.15,55.98 19.05,55.88 19.68,55.24 IC7.16 | 65.41,47.62 65.41,50.8 66.67,52.07 66.67,54.61 65.17,56.12 | 65.17,56.12 65.09,56.2 | C24.+ 64.93,55.88 65.17,56.12
  Top 1.27: 64.77,55.88 C24.+ C25.+ | 64.77,55.88
  Bottom 0.813: JP6.5 20.32,7.62 22.86,10.16 29.21,10.16 30.48,11.43 IC4.8 30.48,14.61 31.11,15.24 C10.1 38.73,10.16 43.81,10.16 JP7.10 | L1.2 68.58,9.53 73.66,4.45 JP8.10 | JP5.1 88.27,57.15 66.04,57.15 64.77,55.88 | v36.51,27.94 v40.64,27.94 | 64.77,55.88 | C24.+ 64.77,55.88 | IC2.16 35.56,66.99 37.72,69.15 C6.- | JP9.10 38.1,47.62 35.56,50.16 35.56,58.36 C22.+ | C24.+
  Bottom 1.27: 62.23,55.88 D2.A | 64.45,55.88 | C24.+ 64.45,55.88 | 64.45,55.88 62.23,55.88 | C25.+ 62.23,55.88 | 62.23,55.88 | D2.A | IC6.3 61.85,59.12 D2.A
VL  (via drill 0.5)
  Top 0.406: IC3.4 28.43,36.21 28.26,36.04 28.43,35.86 IC3.3
  Top 0.813: 30.16,36.04 C21.1 | 30.16,36.04 28.26,36.04 | v30.16,34.45 30.16,36.04
  Bottom 0.813: v30.16,34.45 30.16,36.51 28.57,38.1 28.57,40.16 29.84,41.43 29.84,42.55 31.75,44.45 JP13.2

### Text on the board
Bottom: ISP | SPI | RS232 | PORTD | PORTB | USB | I2C | PORTC | PORTA
tPlace: ISP | RS232 | PortD | PortB | Reset